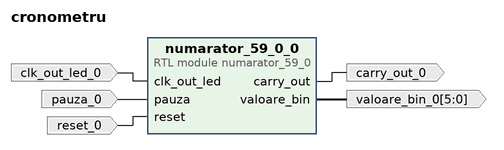
[diagram p0: block diagram of the top level]
# Vivado block design cronometru, xc7a100tcsg324-1, Vivado 2022.1
create_bd_design cronometru

create_bd_port -dir O carry_out_0
create_bd_port -dir I clk_out_led_0
create_bd_port -dir I pauza_0
create_bd_port -dir I -type rst reset_0
create_bd_port -dir O -from 5 -to 0 valoare_bin_0

create_bd_cell -type module -reference numarator_59_0 numarator_59_0_0

# ---- connections ----

connect_bd_net -net clk_out_led_0_1 [get_bd_ports clk_out_led_0] [get_bd_pins numarator_59_0_0/clk_out_led]
connect_bd_net [get_bd_pins numarator_59_0_0/carry_out] [get_bd_ports carry_out_0]
connect_bd_net [get_bd_pins numarator_59_0_0/valoare_bin] [get_bd_ports valoare_bin_0]
connect_bd_net -net pauza_0_1 [get_bd_ports pauza_0] [get_bd_pins numarator_59_0_0/pauza]
connect_bd_net -net reset_0_1 [get_bd_ports reset_0] [get_bd_pins numarator_59_0_0/reset]

validate_bd_design
save_bd_design
